# EAGLE design poe (EAGLE 9.6.2)
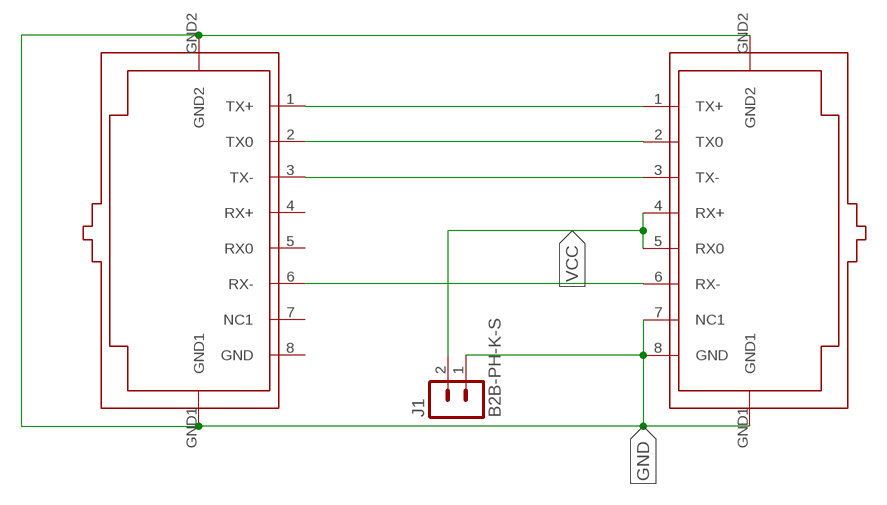
[diagram p0: schematic, sheet 1]

## Parts
J1  B2B-PH-K-S  [B2B-PH-K-S]
U$1  RJ45-TRAFO  [RJ45-TRAFO]
U$2  RJ45-TRAFO  [RJ45-TRAFO]

## Nets
GND: J1.1 U$1.GND1 U$1.GND2 U$2.7(NC1) U$2.8(GND) U$2.GND1 U$2.GND2
N$1: U$1.1(TX+) U$2.1(TX+)
N$2: U$1.2(TX0) U$2.2(TX0)
N$3: U$1.3(TX-) U$2.3(TX-)
N$4: U$1.6(RX-) U$2.6(RX-)
VCC: J1.2 U$2.4(RX+) U$2.5(RX0)
Unconnected: U$1.4(RX+) U$1.5(RX0) U$1.7(NC1) U$1.8(GND)

## Library data of the parts
J1 = con-JST PH:B2B-PH: JST PH series header 2.00mm pitch disconnectable crimp style connectors, vertical (side entry type), 2 pins
U$1 U$2 = con-amphenol-rj45-ld:RJ45-TRAFO: RJ45 socket with integrated magnetics Naming: Amphenol LMJ1598824110DT39 TME RJ45-TRAFO Author: Petr Kalandra <mailto:kalandrap@gmail.com> Datasheet: http://zefiryn.tme.pl/dok/zlacza/rjtrafo.pdf

## Board
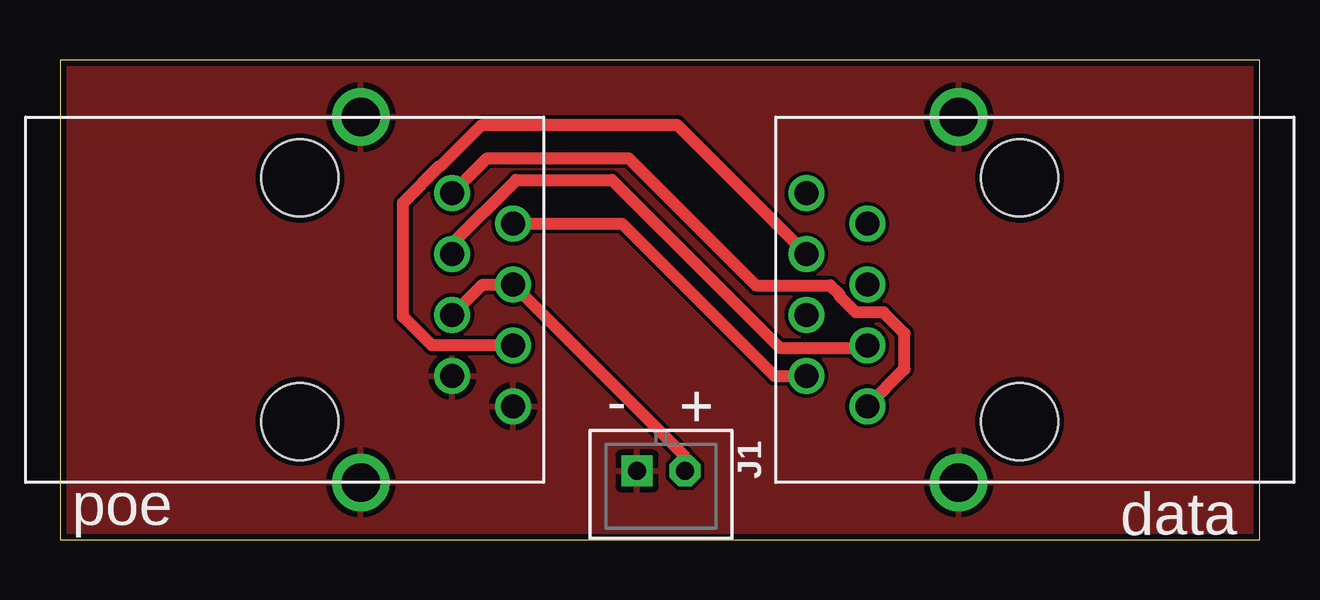
[diagram p1: board, top side]
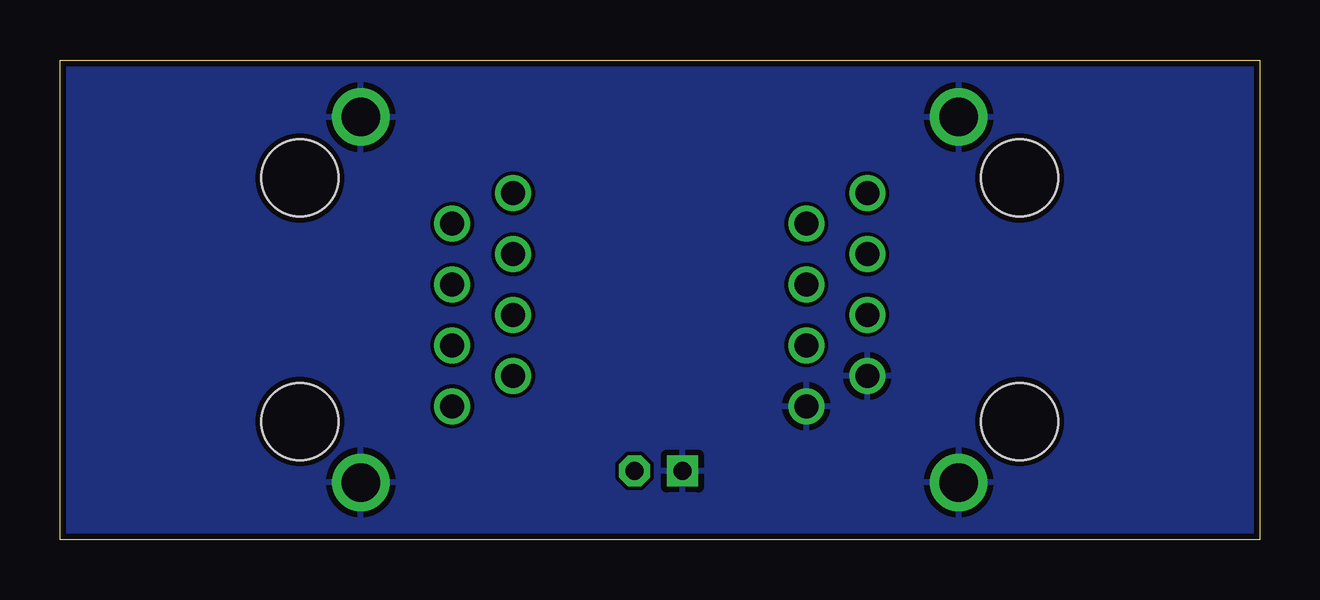
[diagram p2: board, bottom side, seen from below]

Size 50 x 20 mm. Coordinates in mm from the lower left corner, seen from the top.
Outline: 0,0 50,0 50,20 0,20 0,0
Copper layers (1*16): Top 0.035mm / dielectric 1.5mm / Bottom 0.035mm
Design rules "default *": minimum track width 15mil, minimum drill 0.35mm, track to track 6mil, track to pad 6mil, pad to pad 6mil, via to via 6mil, smd to smd 6mil, copper to edge 10mil, drill to drill 6mil, minimum pad ring 10mil, minimum via ring 8mil, stop-mask expansion 4mil, vias tented up to drill 0mil, thermal gap 10mil

### Footprints (pad centres in the part's own frame; a part is rotated, then mirrored left to right if it is on the bottom)
B2B-PH-K-S = drill 0.75 pad 1.3 square: 1 1,0 | drill 0.75 pad 1.3 octagon: 2 -1,0
RJ45-TRAFO = drill 1: 1 -4.445,6.35; 2 -3.175,8.89; 3 -1.905,6.35; 4 -0.635,8.89; 5 0.635,6.35; 6 1.905,8.89; 7 3.175,6.35; 8 4.445,8.89 | drill 1.6: GND1 -7.62,2.54; GND2 7.62,2.54 | hole 3.2: -5.08,0; 5.08,0

### Placement (x,y rotation side)
J1  25.05,2.86 180 top
U$1  40,10 90 top
U$2  10,10 270 top

### Tracks (layer width: path | path; a pad name or v marks a point on that pad's centre or on a via)
GND
  pour Top: 0,20 0,0 50,0 50,20
  pour Bottom: 0,20 0,0 50,0 50,20
N$1
  Top 0.508: U$2.1 17.8,15.9 23.7,15.9 29,10.6 32.1,10.6 32.49,10.21 32.49,10.15 33.17,9.47 34.33,9.47 35.2,8.6 35.2,7.11 U$1.1
N$2
  Top 0.508: U$2.2 23.43,13.18 29.77,6.83 U$1.2
N$3
  Top 0.508: U$2.3 16.35,12.35 19,15 23,15 30,8 33.55,8 U$1.3
N$4
  Top 0.508: U$2.6 15.51,8.1 14.3,9.3 14.3,14.04 15.87,15.61 15.9,15.61 17.6,17.3 25.71,17.3 U$1.6
VCC
  Top 0.508: U$2.5 17.62,10.63 U$2.4 26.02,3.5 J1.2

### Text on the board
tNames: - | + | poe | data